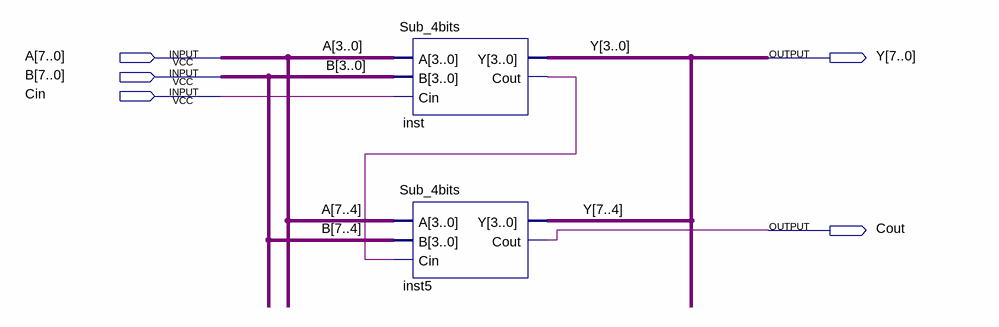
[diagram p0: schematic sheet]
// Quartus schematic Sub_8bits.bdf as structural Verilog: 2 symbols, 5 pins
module Sub_8bits (
  input  [7:0] A,
  input  [7:0] B,
  input  Cin,
  output [7:0] Y,
  output Cout
);

  wire inst_cout;

  Sub_4bits inst (.A(A[3:0]), .B(B[3:0]), .Cin(Cin), .Y(Y[3:0]), .Cout(inst_cout));
  Sub_4bits inst5 (.A(A[7:4]), .B(B[7:4]), .Cin(inst_cout), .Y(Y[7:4]), .Cout(Cout));
endmodule
